# EAGLE design IRGate (EAGLE 9.5.1)
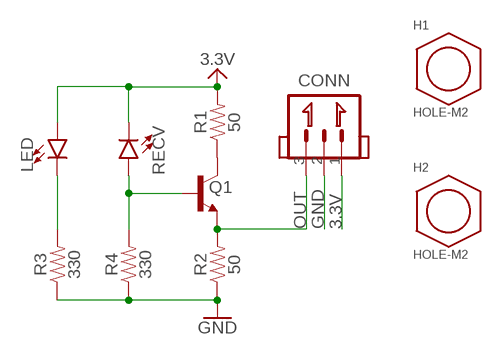
[diagram p0: schematic, sheet 1]

## Parts
CONN  JST_1.25_3P  [JST1.25_3P]
H1  HOLE-M2  [M2]
H2  HOLE-M2  [M2]
LED  LED-IRTSAL6100  [LED_5MM]
Q1  NPNSOT23-3  [SOT23-3]
R1  50  RESISTOR0603  [0603]
R2  50  RESISTOR0603  [0603]
R3  330  RESISTOR0603  [0603]
R4  330  RESISTOR0603  [0603]
RECV  LED-IRSIDE_EMITTER  [LTE-302]

## Nets
3.3V: CONN.1 LED.A R1.2 RECV.C ; supply symbol labelled SUPPLY_3.3V
GND: CONN.2 R2.1 R3.1 R4.1 ; supply symbol labelled SUPPLY_GND
N$1: Q1.3(C) R1.1
N$3: Q1.1(B) R4.2 RECV.A
N$4: LED.K(C) R3.2
OUT: CONN.3 Q1.2(E) R2.2

## Library data of the parts
CONN = Scott-Connectors:JST_1.25_3P
H1 H2 = Scott-Mechanical:HOLE
LED = SparkFun-LED:LED-IR: Infrared LED (IR) Wavelength: 940nm Packages: TSAL6100 LTE302 - Side firing. Check SparkFun-Sensors.lbr for the receiver SparkFun Products: ZX Distance and Gesture Sensor <[https://www.sparkfun.com/products/12780]> Infrared Emitters and Detectors <https://www.sparkfun.com/products/241>; PROD_ID: DIO-12058
Q1 = Scott-Electrical:NPN: Transistor NPN BJT configuration in SOT23 package. MMBT2222 is the common NPN we use. Double check BCE configuration again layout.
R1-R4 = Scott-Electrical:RESISTOR: Generic Resistor Package
RECV = SparkFun-LED:LED-IR: Infrared LED (IR) Wavelength: 940nm Packages: TSAL6100 LTE302 - Side firing. Check SparkFun-Sensors.lbr for the receiver SparkFun Products: ZX Distance and Gesture Sensor <[https://www.sparkfun.com/products/12780]> Infrared Emitters and Detectors <https://www.sparkfun.com/products/241>; PROD_ID: DIO-10904; SF_ID: SEN-00241

## Board
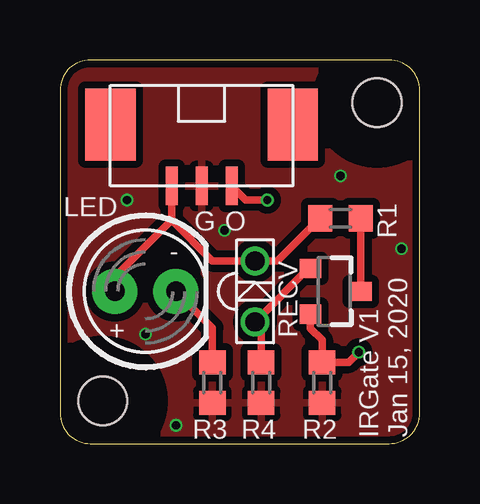
[diagram p1: board, top side]
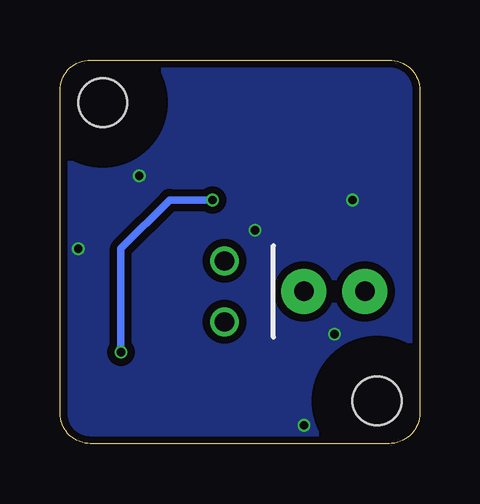
[diagram p2: board, bottom side, seen from below]

Size 14.99 x 16 mm. Coordinates in mm from the lower left corner, seen from the top.
Outline: 0,14.73 0,1.27 arc90 1.27,0 13.72,0 arc90 14.99,1.27 14.99,14.73 arc90 13.72,16 1.27,16 arc90 0,14.73
Copper layers (1*16): Top 0.035559375mm / dielectric 1.6mm / Bottom 0.035559375mm
Design rules "jlcpcb2layer": minimum track width 5mil, minimum drill 12mil, track to track 5mil, track to pad 5mil, pad to pad 5mil, via to via 5mil, smd to smd 5mil, copper to edge 8mil, drill to drill 6mil, minimum pad ring 5mil, minimum via ring 3mil, stop-mask expansion 2.5mil, vias tented up to drill 20mil, thermal gap 10mil

### Footprints (pad centres in the part's own frame; a part is rotated, then mirrored left to right if it is on the bottom)
JST1.25_3P = smd 0.5 x 1.6: 1 0,0; 2 1.25,0; 3 2.5,0 | smd 2.1 x 3: 4 -2.55,2.55; 5 5.05,2.55
M2 = hole 2.032: 0,0
LED_5MM = drill 0.813 pad 1.88: A -1.27,0; K 1.27,0
SOT23-3 = smd 0.8 x 0.9: 1 -0.95,-1; 2 0.95,-1; 3 0,1.1
0603 = smd 1 x 1.1: 1 -0.85,0; 2 0.85,0
LTE-302 = drill 0.8: A 1.27,0; C -1.27,0

### Placement (x,y rotation side)
CONN  4.65,10.74 0 top
H1  1.78,1.78 0 top
H2  13.21,14.22 0 top
LED  3.56,6.35 0 top
Q1  11.43,6.35 270 top
R1  11.68,9.4 180 top
R2  10.92,2.54 90 top
R3  6.35,2.54 90 top
R4  8.38,2.54 90 top
RECV  8.13,6.35 270 top

### Tracks (layer width: path | path; a pad name or v marks a point on that pad's centre or on a via)
3.3V
  Top 0.305: R1.2 9.06,7.62 RECV.C 6.35,7.62 4.65,9.32 | CONN.1 4.65,9.32 | 4.65,9.32 2.29,6.96 LED.A
GND  (via drill 0.35)
  other vias: 2.79,10.16 6.86,8.89 14.22,8.13 11.68,11.18 3.56,4.57 4.83,0.76
  pour Top (isolate 0.305): -0.51,16.51 -0.51,-0.76 16.26,-0.76 16.26,16.51
  pour Bottom (isolate 0.305): -0.51,16.51 16.51,16.51 16.51,-0.76 -0.51,-0.76
N$1
  Top 0.305: R1.1 Q1.3
N$3
  Top 0.305: R4.2 8.38,4.83 RECV.A 10.35,7.3 Q1.1
N$4
  Top 0.305: R3.2 6.35,4.83 LED.K
OUT  (via drill 0.35)
  Top 0.305: Q1.2 10.43,4.81 10.92,4.32 R2.2 12.03,3.39 v12.45,3.81 | v8.64,10.16 7.73,10.16 CONN.3
  Bottom 0.305: v12.45,3.81 12.45,8.13 10.41,10.16 v8.64,10.16

### Text on the board
tPlace: G | O | - | + | IRGate V1 / Jan 15, 2020